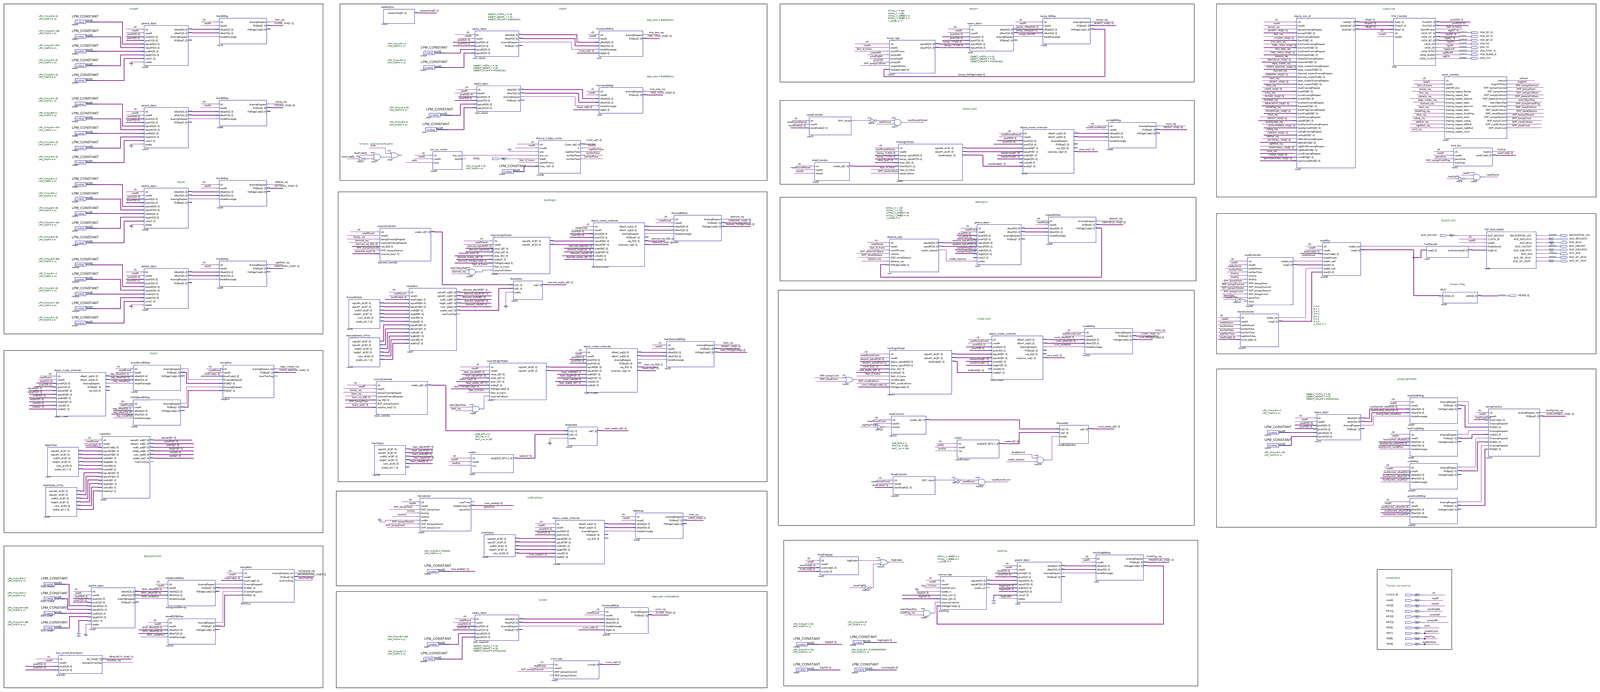
[diagram p0: schematic sheet, whole]
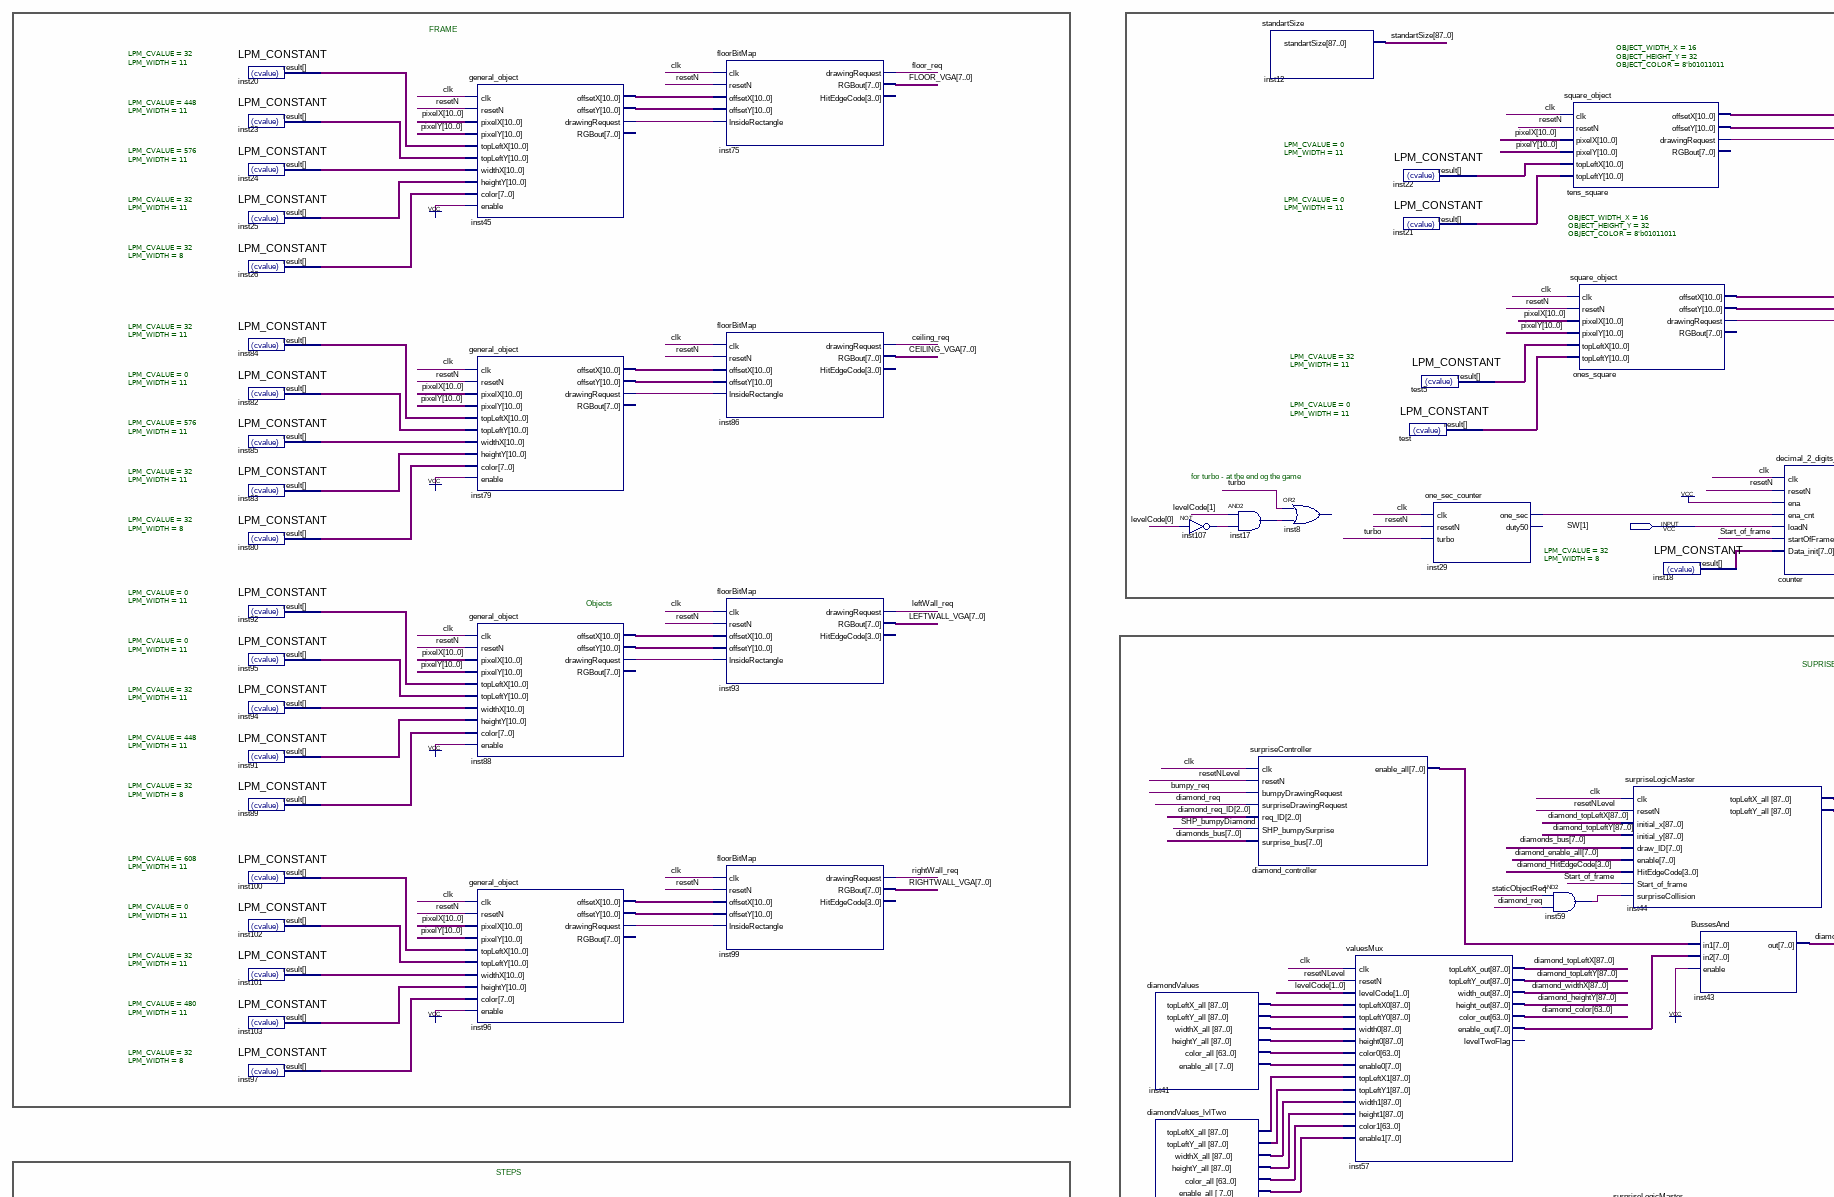
[diagram p1: schematic sheet, upper left part]
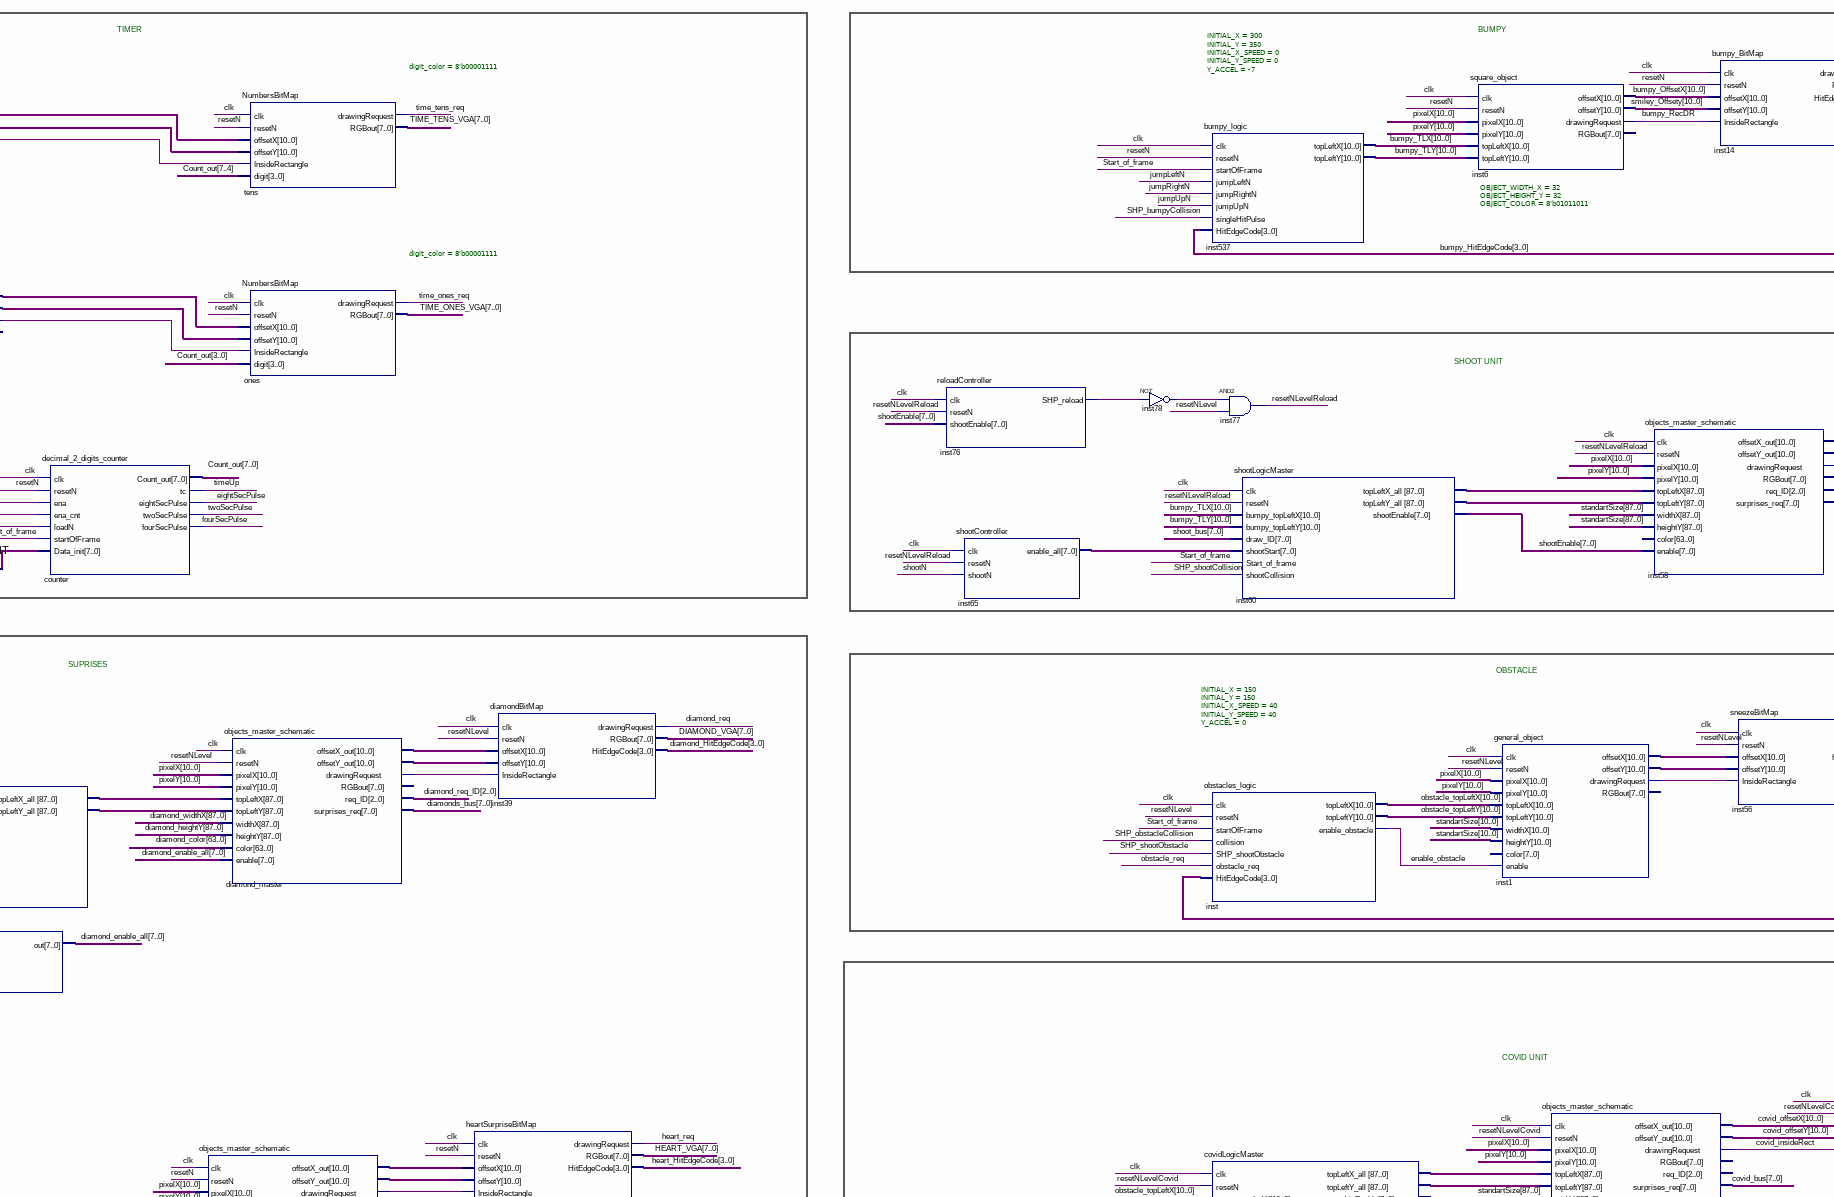
[diagram p2: schematic sheet, upper centre part]
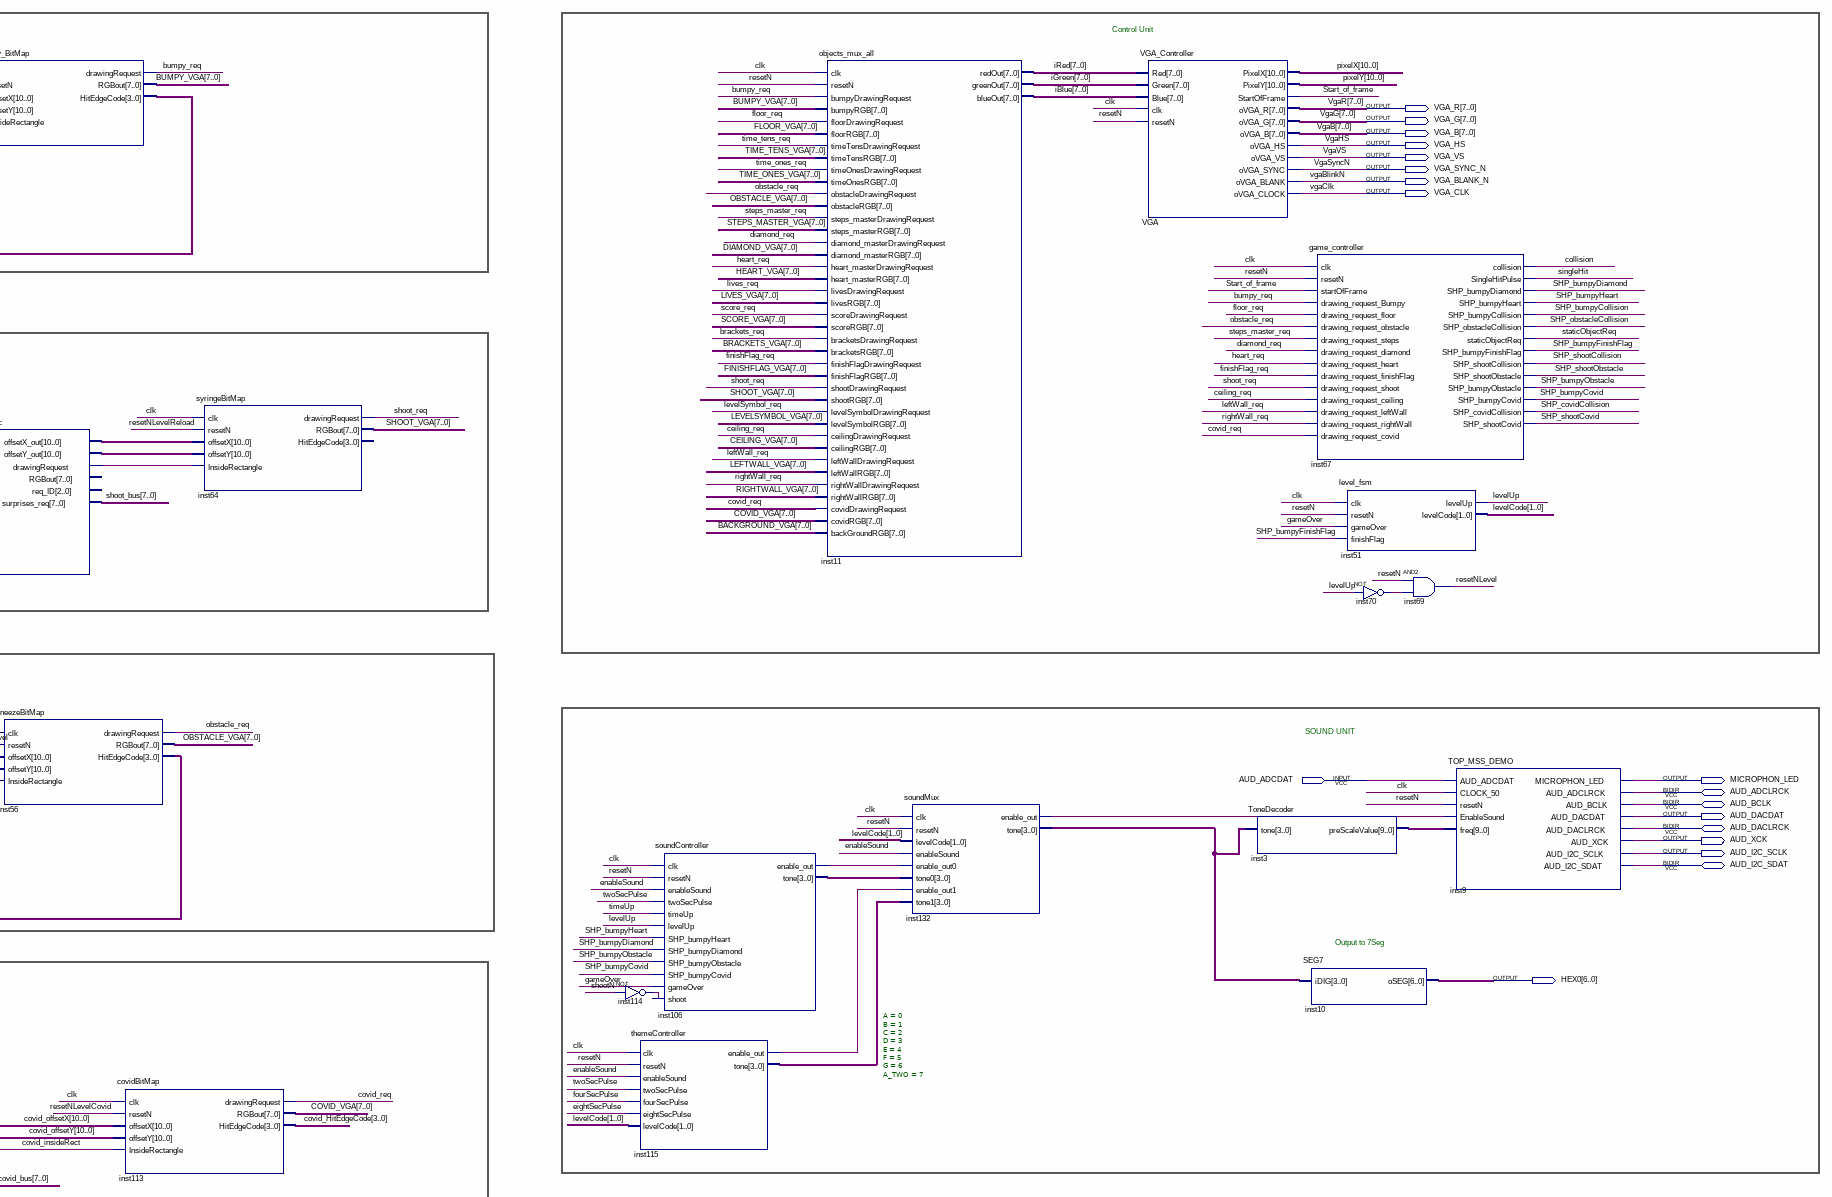
[diagram p3: schematic sheet, upper right part]
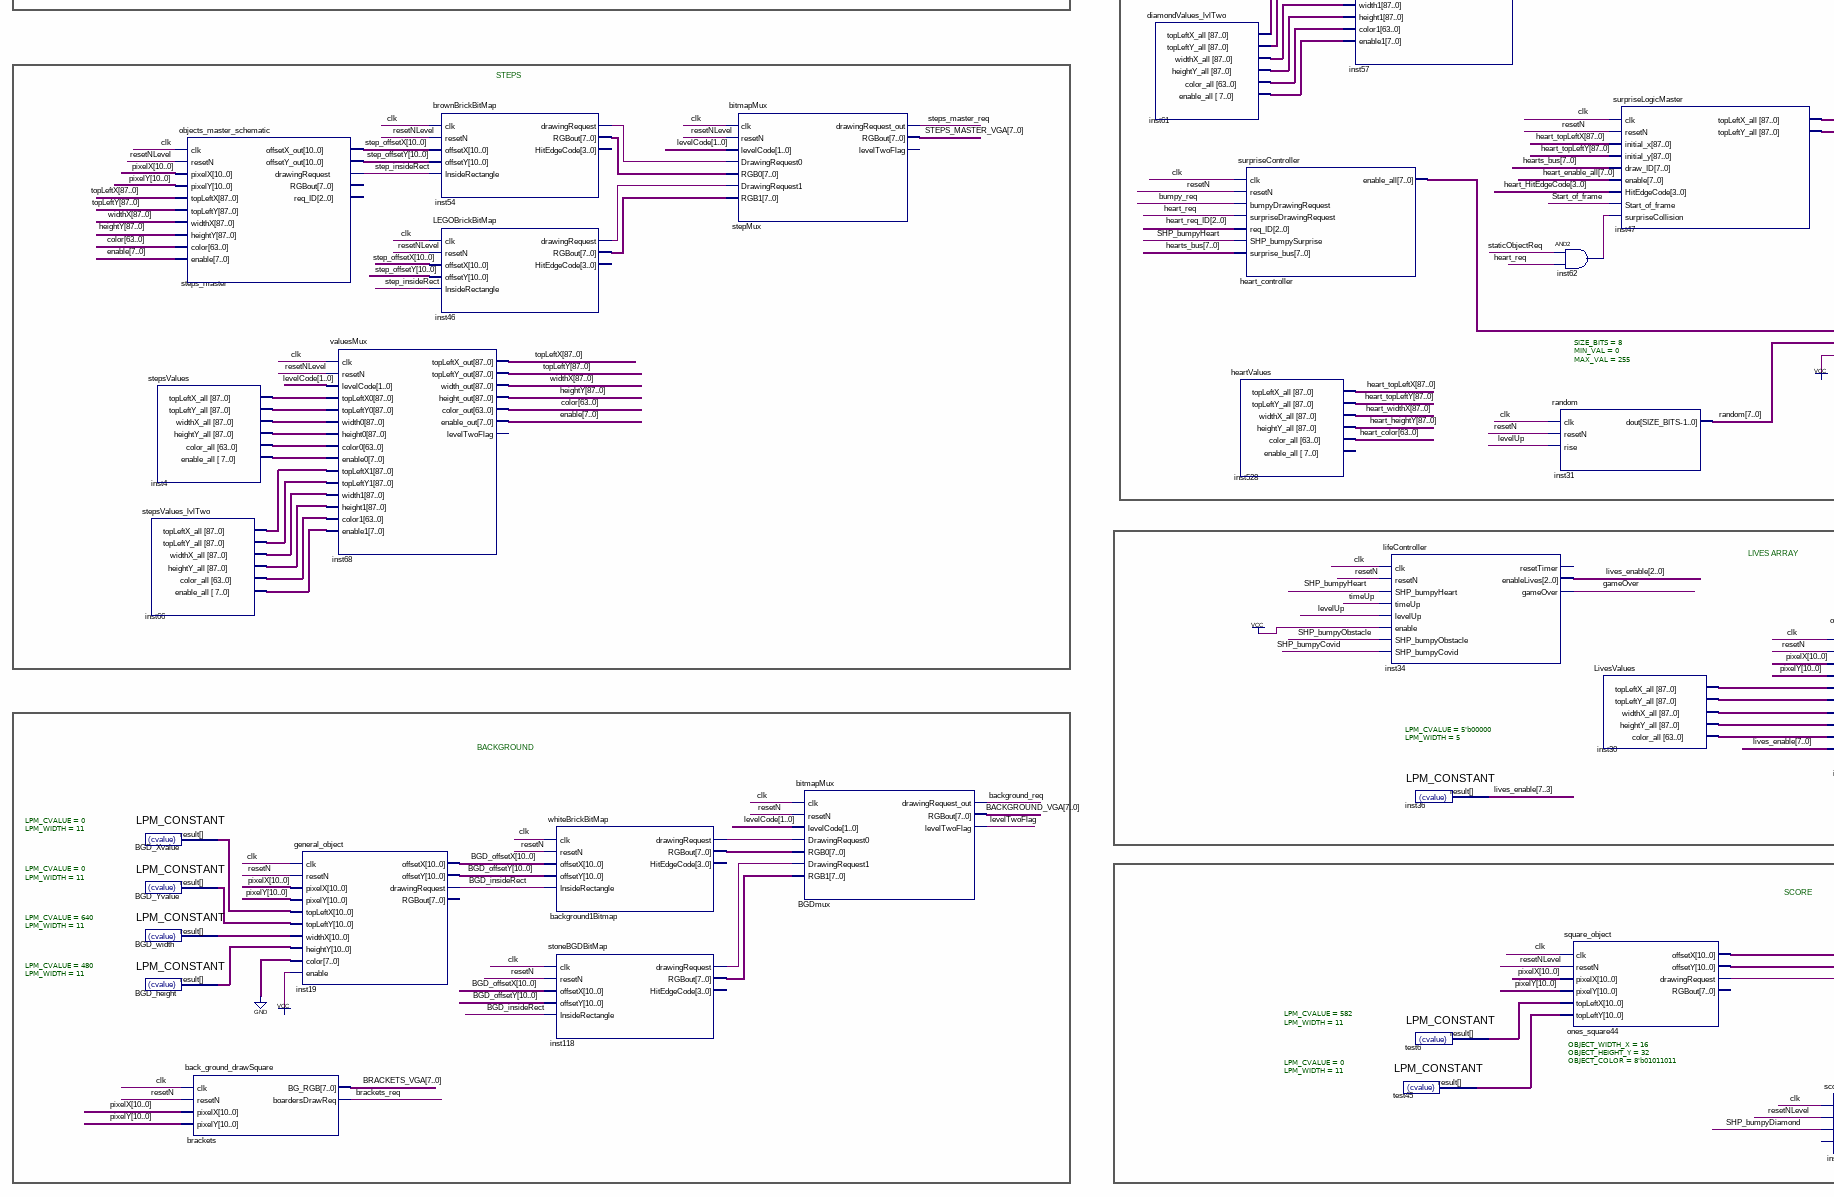
[diagram p4: schematic sheet, lower left part]
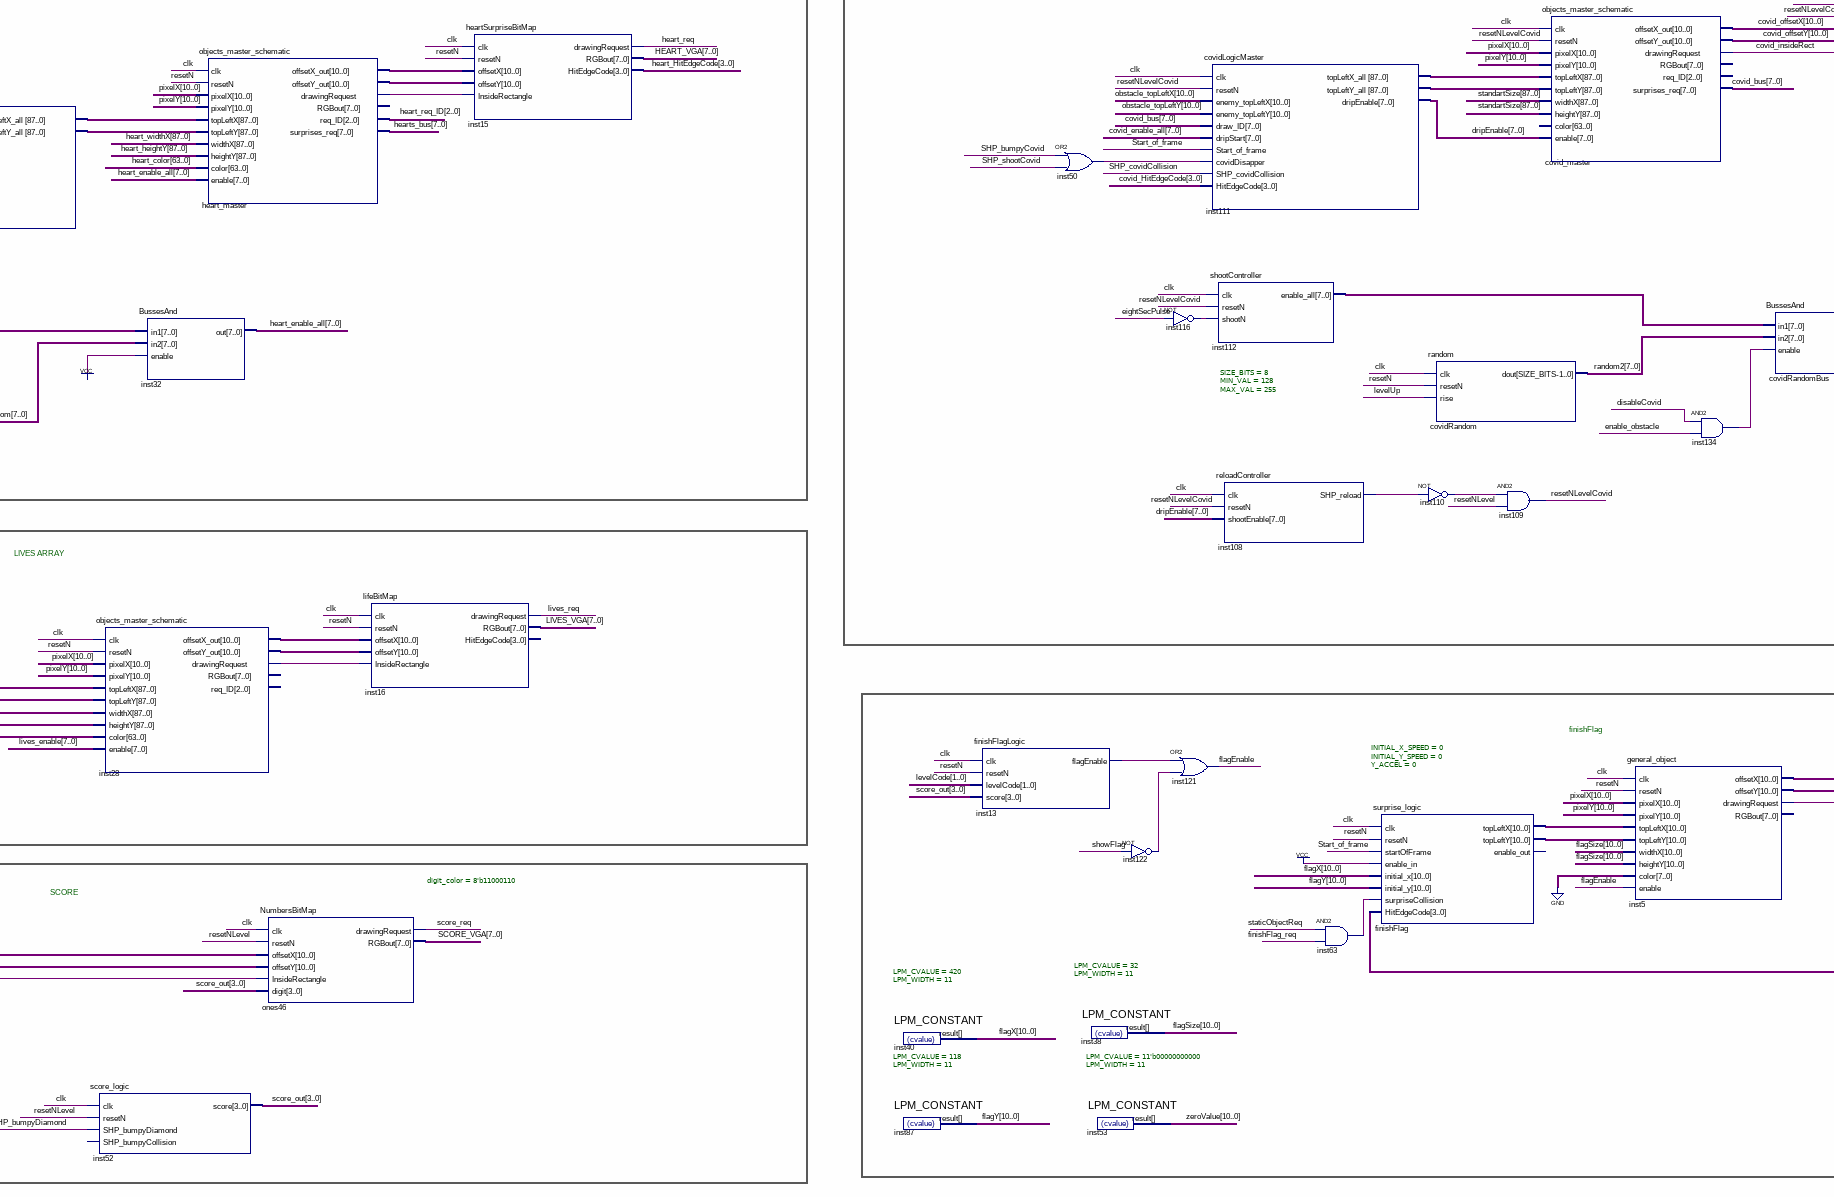
[diagram p5: schematic sheet, lower centre part]
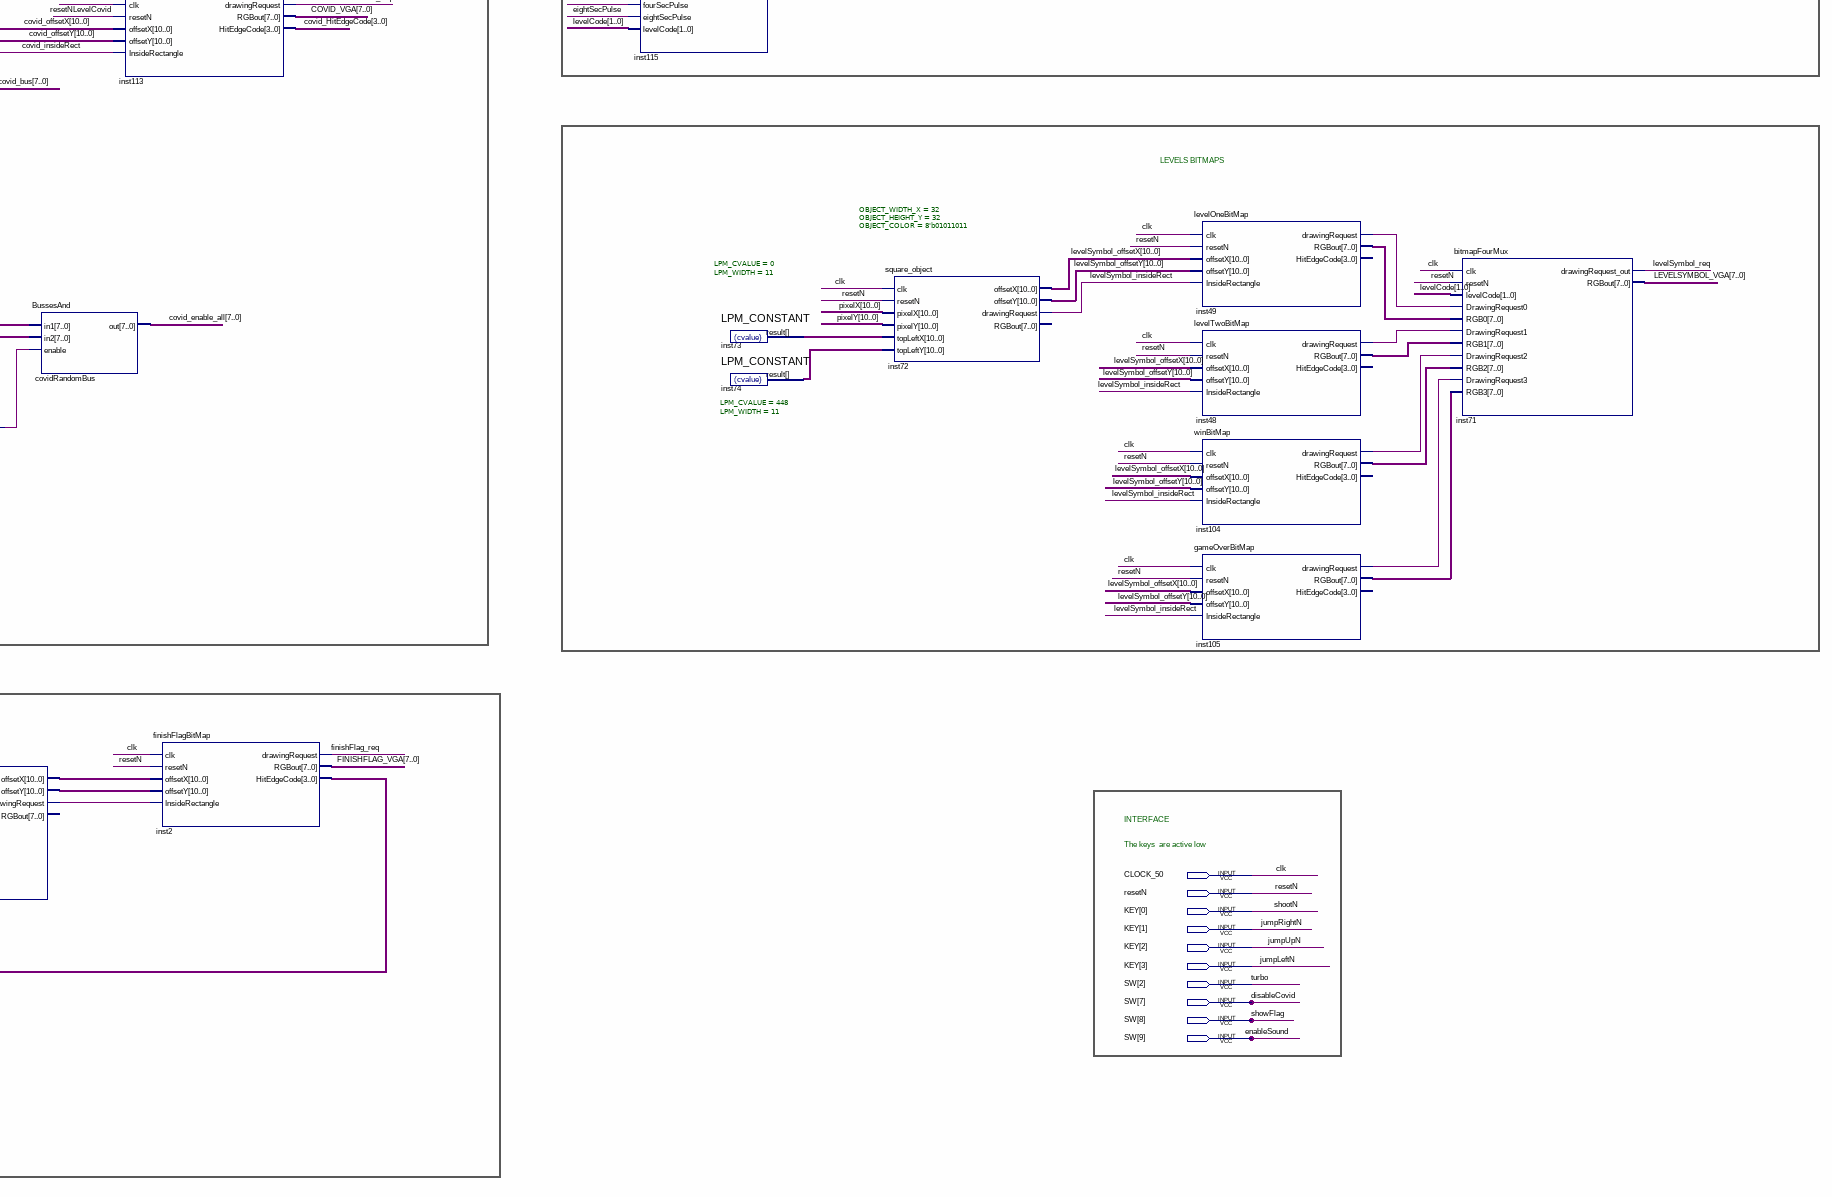
[diagram p6: schematic sheet, lower right part]
// Quartus schematic TOP_VGA_DEMO_WITH_MSS_ALL.bdf as structural Verilog: 143 symbols, 29 pins
module TOP_VGA_DEMO_WITH_MSS_ALL (
  input  [9:1] SW,
  input  AUD_ADCDAT,
  input  CLOCK_50,
  input  resetN,
  input  [3:0] KEY,
  inout  AUD_ADCLRCK,
  inout  AUD_BCLK,
  inout  AUD_DACLRCK,
  inout  AUD_I2C_SDAT,
  output [7:0] VGA_R,
  output [7:0] VGA_G,
  output [7:0] VGA_B,
  output VGA_HS,
  output VGA_VS,
  output VGA_SYNC_N,
  output VGA_BLANK_N,
  output VGA_CLK,
  output MICROPHON_LED,
  output AUD_DACDAT,
  output AUD_XCK,
  output AUD_I2C_SCLK,
  output [6:0] HEX0
);

  wire background1Bitmap_drawingrequest, background_req, BGD_insideRect, brackets_req, bumpy_RecDR,
       bumpy_req, ceiling_req, collision, covid_insideRect, covid_req, diamond_master_drawingrequest,
       diamond_req, eightSecPulse, enable_obstacle, finishFlag_req, flagEnable, floor_req, fourSecPulse,
       gameOver, heart_master_drawingrequest, heart_req, inst1_drawingrequest, inst5_drawingrequest,
       inst13_flagenable, inst17_out, inst28_drawingrequest, inst29_one_sec, inst45_drawingrequest,
       inst46_drawingrequest, inst48_drawingrequest, inst49_drawingrequest, inst50_out,
       inst54_drawingrequest, inst58_drawingrequest, inst59_out, inst62_out, inst63_out, inst70_out,
       inst76_shp_reload, inst78_out, inst79_drawingrequest, inst88_drawingrequest, inst96_drawingrequest,
       inst104_drawingrequest, inst105_drawingrequest, inst106_enable_out, inst107_out, inst108_shp_reload,
       inst110_out, inst114_out, inst115_enable_out, inst116_out, inst118_drawingrequest, inst122_out,
       inst132_enable_out, inst134_out, leftWall_req, levelSymbol_insideRect, levelSymbol_req, levelTwoFlag,
       levelUp, lives_req, obstacle_req, ones_square44_drawingrequest, ones_square_drawingrequest,
       resetNLevel, resetNLevelCovid, resetNLevelReload, rightWall_req, score_req, shoot_req,
       SHP_bumpyCollision, SHP_bumpyCovid, SHP_bumpyDiamond, SHP_bumpyFinishFlag, SHP_bumpyHeart,
       SHP_bumpyObstacle, SHP_covidCollision, SHP_obstacleCollision, SHP_shootCollision, SHP_shootCovid,
       SHP_shootObstacle, singleHit, Start_of_frame, staticObjectReq, step_insideRect, steps_master_req,
       tens_square_drawingrequest, time_ones_req, time_tens_req, timeUp, twoSecPulse;
  wire [1:0] levelCode;
  wire [2:0] diamond_req_ID, heart_req_ID;
  wire [3:0] bumpy_HitEdgeCode, covid_HitEdgeCode, diamond_HitEdgeCode, heart_HitEdgeCode, inst2_hitedgecode,
       inst56_hitedgecode, inst106_tone, inst115_tone, inst132_tone, score_out;
  wire [7:0] background1Bitmap_rgbout, BACKGROUND_VGA, BRACKETS_VGA, BUMPY_VGA, CEILING_VGA, Count_out,
       covid_bus, covid_enable_all, COVID_VGA, diamond_controller_enable_all, diamond_enable_all,
       DIAMOND_VGA, diamonds_bus, dripEnable, enable, FINISHFLAG_VGA, FLOOR_VGA, heart_controller_enable_all,
       heart_enable_all, HEART_VGA, hearts_bus, iBlue, iGreen, inst4_enable_all, inst18_result,
       inst26_result, inst41_enable_all, inst46_rgbout, inst48_rgbout, inst49_rgbout, inst54_rgbout,
       inst57_enable_out, inst61_enable_all, inst65_enable_all, inst66_enable_all, inst80_result,
       inst89_result, inst97_result, inst104_rgbout, inst105_rgbout, inst112_enable_all, inst118_rgbout,
       iRed, LEFTWALL_VGA, LEVELSYMBOL_VGA, lives_enable, LIVES_VGA, OBSTACLE_VGA, random, random2,
       RIGHTWALL_VGA, SCORE_VGA, shoot_bus, SHOOT_VGA, shootEnable, STEPS_MASTER_VGA, TIME_ONES_VGA,
       TIME_TENS_VGA;
  wire [9:0] inst3_prescalevalue;
  wire [10:0] BGD_height_result, BGD_offsetX, BGD_offsetY, BGD_width_result, BGD_Xvalue_result,
       BGD_Yvalue_result, bumpy_OffsetX, bumpy_TLX, bumpy_TLY, covid_offsetX, covid_offsetY,
       diamond_master_offsetx_out, diamond_master_offsety_out, finishFlag_topleftx, finishFlag_toplefty,
       flagSize, flagX, flagY, heart_master_offsetx_out, heart_master_offsety_out, inst1_offsetx,
       inst1_offsety, inst5_offsetx, inst5_offsety, inst20_result, inst21_result, inst22_result,
       inst23_result, inst24_result, inst25_result, inst28_offsetx_out, inst28_offsety_out, inst45_offsetx,
       inst45_offsety, inst58_offsetx_out, inst58_offsety_out, inst73_result, inst74_result, inst79_offsetx,
       inst79_offsety, inst82_result, inst83_result, inst84_result, inst85_result, inst88_offsetx,
       inst88_offsety, inst91_result, inst92_result, inst94_result, inst95_result, inst96_offsetx,
       inst96_offsety, inst100_result, inst101_result, inst102_result, inst103_result, levelSymbol_offsetX,
       levelSymbol_offsetY, obstacle_topLeftX, obstacle_topLeftY, ones_square44_offsetx,
       ones_square44_offsety, ones_square_offsetx, ones_square_offsety, pixelX, pixelY, smiley_Offsety,
       step_offsetX, step_offsetY, tens_square_offsetx, tens_square_offsety, test5_result, test6_result,
       test45_result, test_result, zeroValue;
  wire [63:0] color, diamond_color, heart_color, inst4_color_all, inst30_color_all, inst41_color_all,
       inst61_color_all, inst66_color_all;
  wire [87:0] diamond_heightY, diamond_topLeftX, diamond_topLeftY, diamond_widthX, heart_heightY,
       heart_topLeftX, heart_topLeftY, heart_widthX, heightY, inst4_heighty_all, inst4_topleftx_all,
       inst4_toplefty_all, inst4_widthx_all, inst30_heighty_all, inst30_topleftx_all, inst30_toplefty_all,
       inst30_widthx_all, inst41_heighty_all, inst41_topleftx_all, inst41_toplefty_all, inst41_widthx_all,
       inst44_topleftx_all, inst44_toplefty_all, inst47_topleftx_all, inst47_toplefty_all,
       inst60_topleftx_all, inst60_toplefty_all, inst61_heighty_all, inst61_topleftx_all,
       inst61_toplefty_all, inst61_widthx_all, inst66_heighty_all, inst66_topleftx_all, inst66_toplefty_all,
       inst66_widthx_all, inst111_topleftx_all, inst111_toplefty_all, standartSize, topLeftX, topLeftY,
       widthX;

  stepsValues inst4 (
    .topLeftX_all(inst4_topleftx_all), .topLeftY_all(inst4_toplefty_all), .widthX_all(inst4_widthx_all),
    .heightY_all(inst4_heighty_all), .color_all(inst4_color_all), .enable_all(inst4_enable_all));
  stepsValues_lvlTwo inst66 (
    .topLeftX_all(inst66_topleftx_all), .topLeftY_all(inst66_toplefty_all), .widthX_all(inst66_widthx_all),
    .heightY_all(inst66_heighty_all), .color_all(inst66_color_all), .enable_all(inst66_enable_all));
  LPM_CONSTANT #(.LPM_CVALUE(0), .LPM_WIDTH(11)) BGD_Xvalue (.result(BGD_Xvalue_result));
  LPM_CONSTANT #(.LPM_CVALUE(0), .LPM_WIDTH(11)) BGD_Yvalue (.result(BGD_Yvalue_result));
  LPM_CONSTANT #(.LPM_CVALUE(640), .LPM_WIDTH(11)) BGD_width (.result(BGD_width_result));
  LPM_CONSTANT #(.LPM_CVALUE(480), .LPM_WIDTH(11)) BGD_height (.result(BGD_height_result));
  objects_master_schematic steps_master (
    .clk(CLOCK_50), .resetN(resetNLevel), .pixelX(pixelX), .pixelY(pixelY), .topLeftX(topLeftX),
    .topLeftY(topLeftY), .widthX(widthX), .heightY(heightY), .color(color), .enable(enable),
    .offsetX_out(step_offsetX), .offsetY_out(step_offsetY), .drawingRequest(step_insideRect));  // open: RGBout, req_ID
  back_ground_drawSquare brackets (
    .clk(CLOCK_50), .resetN(resetN), .pixelX(pixelX), .pixelY(pixelY), .BG_RGB(BRACKETS_VGA),
    .boardersDrawReq(brackets_req));
  LPM_CONSTANT #(.LPM_CVALUE(32), .LPM_WIDTH(11)) inst20 (.result(inst20_result));
  LPM_CONSTANT #(.LPM_CVALUE(448), .LPM_WIDTH(11)) inst23 (.result(inst23_result));
  LPM_CONSTANT #(.LPM_CVALUE(576), .LPM_WIDTH(11)) inst24 (.result(inst24_result));
  LPM_CONSTANT #(.LPM_CVALUE(32), .LPM_WIDTH(11)) inst25 (.result(inst25_result));
  LPM_CONSTANT #(.LPM_CVALUE(32), .LPM_WIDTH(8)) inst26 (.result(inst26_result));
  LPM_CONSTANT #(.LPM_CVALUE(32), .LPM_WIDTH(11)) inst84 (.result(inst84_result));
  LPM_CONSTANT #(.LPM_CVALUE(0), .LPM_WIDTH(11)) inst82 (.result(inst82_result));
  LPM_CONSTANT #(.LPM_CVALUE(576), .LPM_WIDTH(11)) inst85 (.result(inst85_result));
  LPM_CONSTANT #(.LPM_CVALUE(32), .LPM_WIDTH(11)) inst83 (.result(inst83_result));
  LPM_CONSTANT #(.LPM_CVALUE(32), .LPM_WIDTH(8)) inst80 (.result(inst80_result));
  LPM_CONSTANT #(.LPM_CVALUE(0), .LPM_WIDTH(11)) inst92 (.result(inst92_result));
  LPM_CONSTANT #(.LPM_CVALUE(0), .LPM_WIDTH(11)) inst95 (.result(inst95_result));
  LPM_CONSTANT #(.LPM_CVALUE(32), .LPM_WIDTH(11)) inst94 (.result(inst94_result));
  LPM_CONSTANT #(.LPM_CVALUE(448), .LPM_WIDTH(11)) inst91 (.result(inst91_result));
  LPM_CONSTANT #(.LPM_CVALUE(32), .LPM_WIDTH(8)) inst89 (.result(inst89_result));
  LPM_CONSTANT #(.LPM_CVALUE(608), .LPM_WIDTH(11)) inst100 (.result(inst100_result));
  LPM_CONSTANT #(.LPM_CVALUE(0), .LPM_WIDTH(11)) inst102 (.result(inst102_result));
  LPM_CONSTANT #(.LPM_CVALUE(32), .LPM_WIDTH(11)) inst101 (.result(inst101_result));
  LPM_CONSTANT #(.LPM_CVALUE(480), .LPM_WIDTH(11)) inst103 (.result(inst103_result));
  LPM_CONSTANT #(.LPM_CVALUE(32), .LPM_WIDTH(8)) inst97 (.result(inst97_result));
  general_object inst19 (
    .clk(CLOCK_50), .resetN(resetN), .pixelX(pixelX), .pixelY(pixelY), .topLeftX(BGD_Xvalue_result),
    .topLeftY(BGD_Yvalue_result), .widthX(BGD_width_result), .heightY(BGD_height_result), .color({8{1'b0}}),
    .enable(1'b1), .offsetX(BGD_offsetX), .offsetY(BGD_offsetY), .drawingRequest(BGD_insideRect));  // open: RGBout
  valuesMux inst68 (
    .clk(CLOCK_50), .resetN(resetNLevel), .levelCode(levelCode), .topLeftX0(inst4_topleftx_all),
    .topLeftY0(inst4_toplefty_all), .width0(inst4_widthx_all), .height0(inst4_heighty_all),
    .color0(inst4_color_all), .enable0(inst4_enable_all), .topLeftX1(inst66_topleftx_all),
    .topLeftY1(inst66_toplefty_all), .width1(inst66_widthx_all), .height1(inst66_heighty_all),
    .color1(inst66_color_all), .enable1(inst66_enable_all), .topLeftX_out(topLeftX), .topLeftY_out(topLeftY),
    .width_out(widthX), .height_out(heightY), .color_out(color), .enable_out(enable));  // open: levelTwoFlag
  brownBrickBitMap inst54 (
    .clk(CLOCK_50), .resetN(resetNLevel), .offsetX(step_offsetX), .offsetY(step_offsetY),
    .InsideRectangle(step_insideRect), .drawingRequest(inst54_drawingrequest), .RGBout(inst54_rgbout));  // open: HitEdgeCode
  LEGOBrickBitMap inst46 (
    .clk(CLOCK_50), .resetN(resetNLevel), .offsetX(step_offsetX), .offsetY(step_offsetY),
    .InsideRectangle(step_insideRect), .drawingRequest(inst46_drawingrequest), .RGBout(inst46_rgbout));  // open: HitEdgeCode
  general_object inst45 (
    .clk(CLOCK_50), .resetN(resetN), .pixelX(pixelX), .pixelY(pixelY), .topLeftX(inst20_result),
    .topLeftY(inst23_result), .widthX(inst24_result), .heightY(inst25_result), .color(inst26_result),
    .enable(1'b1), .offsetX(inst45_offsetx), .offsetY(inst45_offsety), .drawingRequest(inst45_drawingrequest));  // open: RGBout
  general_object inst79 (
    .clk(CLOCK_50), .resetN(resetN), .pixelX(pixelX), .pixelY(pixelY), .topLeftX(inst84_result),
    .topLeftY(inst82_result), .widthX(inst85_result), .heightY(inst83_result), .color(inst80_result),
    .enable(1'b1), .offsetX(inst79_offsetx), .offsetY(inst79_offsety), .drawingRequest(inst79_drawingrequest));  // open: RGBout
  general_object inst88 (
    .clk(CLOCK_50), .resetN(resetN), .pixelX(pixelX), .pixelY(pixelY), .topLeftX(inst92_result),
    .topLeftY(inst95_result), .widthX(inst94_result), .heightY(inst91_result), .color(inst89_result),
    .enable(1'b1), .offsetX(inst88_offsetx), .offsetY(inst88_offsety), .drawingRequest(inst88_drawingrequest));  // open: RGBout
  general_object inst96 (
    .clk(CLOCK_50), .resetN(resetN), .pixelX(pixelX), .pixelY(pixelY), .topLeftX(inst100_result),
    .topLeftY(inst102_result), .widthX(inst101_result), .heightY(inst103_result), .color(inst97_result),
    .enable(1'b1), .offsetX(inst96_offsetx), .offsetY(inst96_offsety), .drawingRequest(inst96_drawingrequest));  // open: RGBout
  whiteBrickBitMap background1Bitmap (
    .clk(CLOCK_50), .resetN(resetN), .offsetX(BGD_offsetX), .offsetY(BGD_offsetY),
    .InsideRectangle(BGD_insideRect), .drawingRequest(background1Bitmap_drawingrequest),
    .RGBout(background1Bitmap_rgbout));  // open: HitEdgeCode
  stoneBGDBitMap inst118 (
    .clk(CLOCK_50), .resetN(resetN), .offsetX(BGD_offsetX), .offsetY(BGD_offsetY),
    .InsideRectangle(BGD_insideRect), .drawingRequest(inst118_drawingrequest), .RGBout(inst118_rgbout));  // open: HitEdgeCode
  floorBitMap inst75 (
    .clk(CLOCK_50), .resetN(resetN), .offsetX(inst45_offsetx), .offsetY(inst45_offsety),
    .InsideRectangle(inst45_drawingrequest), .drawingRequest(floor_req), .RGBout(FLOOR_VGA));  // open: HitEdgeCode
  floorBitMap inst86 (
    .clk(CLOCK_50), .resetN(resetN), .offsetX(inst79_offsetx), .offsetY(inst79_offsety),
    .InsideRectangle(inst79_drawingrequest), .drawingRequest(ceiling_req), .RGBout(CEILING_VGA));  // open: HitEdgeCode
  floorBitMap inst93 (
    .clk(CLOCK_50), .resetN(resetN), .offsetX(inst88_offsetx), .offsetY(inst88_offsety),
    .InsideRectangle(inst88_drawingrequest), .drawingRequest(leftWall_req), .RGBout(LEFTWALL_VGA));  // open: HitEdgeCode
  floorBitMap inst99 (
    .clk(CLOCK_50), .resetN(resetN), .offsetX(inst96_offsetx), .offsetY(inst96_offsety),
    .InsideRectangle(inst96_drawingrequest), .drawingRequest(rightWall_req), .RGBout(RIGHTWALL_VGA));  // open: HitEdgeCode
  bitmapMux stepMux (
    .clk(CLOCK_50), .resetN(resetNLevel), .levelCode(levelCode), .DrawingRequest0(inst54_drawingrequest),
    .RGB0(inst54_rgbout), .DrawingRequest1(inst46_drawingrequest), .RGB1(inst46_rgbout),
    .drawingRequest_out(steps_master_req), .RGBout(STEPS_MASTER_VGA));  // open: levelTwoFlag
  bitmapMux BGDmux (
    .clk(CLOCK_50), .resetN(resetN), .levelCode(levelCode),
    .DrawingRequest0(background1Bitmap_drawingrequest), .RGB0(background1Bitmap_rgbout),
    .DrawingRequest1(inst118_drawingrequest), .RGB1(inst118_rgbout), .drawingRequest_out(background_req),
    .RGBout(BACKGROUND_VGA), .levelTwoFlag(levelTwoFlag));
  diamondValues inst41 (
    .topLeftX_all(inst41_topleftx_all), .topLeftY_all(inst41_toplefty_all), .widthX_all(inst41_widthx_all),
    .heightY_all(inst41_heighty_all), .color_all(inst41_color_all), .enable_all(inst41_enable_all));
  diamondValues_lvlTwo inst61 (
    .topLeftX_all(inst61_topleftx_all), .topLeftY_all(inst61_toplefty_all), .widthX_all(inst61_widthx_all),
    .heightY_all(inst61_heighty_all), .color_all(inst61_color_all), .enable_all(inst61_enable_all));
  not inst107 (inst107_out, levelCode[0]);
  standartSize inst12 (.standartSize(standartSize));
  and inst17 (inst17_out, levelCode[1], inst107_out);
  surpriseController diamond_controller (
    .clk(CLOCK_50), .resetN(resetNLevel), .bumpyDrawingRequest(bumpy_req),
    .surpriseDrawingRequest(diamond_req), .req_ID(diamond_req_ID), .SHP_bumpySurprise(SHP_bumpyDiamond),
    .surprise_bus(diamonds_bus), .enable_all(diamond_controller_enable_all));
  surpriseController heart_controller (
    .clk(CLOCK_50), .resetN(resetN), .bumpyDrawingRequest(bumpy_req), .surpriseDrawingRequest(heart_req),
    .req_ID(heart_req_ID), .SHP_bumpySurprise(SHP_bumpyHeart), .surprise_bus(hearts_bus),
    .enable_all(heart_controller_enable_all));
  heartValues inst528 (
    .topLeftX_all(heart_topLeftX), .topLeftY_all(heart_topLeftY), .widthX_all(heart_widthX),
    .heightY_all(heart_heightY), .color_all(heart_color));  // open: enable_all
  // OR2 inst8 has open pins: IN1=SW[2], IN2=inst17_out, OUT=open
  valuesMux inst57 (
    .clk(CLOCK_50), .resetN(resetNLevel), .levelCode(levelCode), .topLeftX0(inst41_topleftx_all),
    .topLeftY0(inst41_toplefty_all), .width0(inst41_widthx_all), .height0(inst41_heighty_all),
    .color0(inst41_color_all), .enable0(inst41_enable_all), .topLeftX1(inst61_topleftx_all),
    .topLeftY1(inst61_toplefty_all), .width1(inst61_widthx_all), .height1(inst61_heighty_all),
    .color1(inst61_color_all), .enable1(inst61_enable_all), .topLeftX_out(diamond_topLeftX),
    .topLeftY_out(diamond_topLeftY), .width_out(diamond_widthX), .height_out(diamond_heightY),
    .color_out(diamond_color), .enable_out(inst57_enable_out));  // open: levelTwoFlag
  LPM_CONSTANT #(.LPM_CVALUE(0), .LPM_WIDTH(11)) inst22 (.result(inst22_result));
  LPM_CONSTANT #(.LPM_CVALUE(0), .LPM_WIDTH(11)) inst21 (.result(inst21_result));
  LPM_CONSTANT #(.LPM_CVALUE(32), .LPM_WIDTH(11)) test5 (.result(test5_result));
  LPM_CONSTANT #(.LPM_CVALUE(0), .LPM_WIDTH(11)) test (.result(test_result));
  lifeController inst34 (
    .clk(CLOCK_50), .resetN(resetN), .SHP_bumpyHeart(SHP_bumpyHeart), .timeUp(timeUp), .levelUp(levelUp),
    .enable(1'b1), .SHP_bumpyObstacle(SHP_bumpyObstacle), .SHP_bumpyCovid(SHP_bumpyCovid),
    .enableLives(lives_enable[2:0]), .gameOver(gameOver));  // open: resetTimer
  LPM_CONSTANT #(.LPM_CVALUE(5'b00000), .LPM_WIDTH(5)) inst36 (.result(lives_enable[7:3]));
  LPM_CONSTANT #(.LPM_CVALUE(582), .LPM_WIDTH(11)) test6 (.result(test6_result));
  LPM_CONSTANT #(.LPM_CVALUE(0), .LPM_WIDTH(11)) test45 (.result(test45_result));
  one_sec_counter inst29 (.clk(CLOCK_50), .resetN(resetN), .turbo(SW[2]), .one_sec(inst29_one_sec));  // open: duty50
  square_object #(.OBJECT_WIDTH_X(16), .OBJECT_HEIGHT_Y(32), .OBJECT_COLOR(8'b01011011)) tens_square (
    .clk(CLOCK_50), .resetN(resetN), .pixelX(pixelX), .pixelY(pixelY), .topLeftX(inst22_result),
    .topLeftY(inst21_result), .offsetX(tens_square_offsetx), .offsetY(tens_square_offsety),
    .drawingRequest(tens_square_drawingrequest));  // open: RGBout
  and inst59 (inst59_out, staticObjectReq, diamond_req);
  and inst62 (inst62_out, staticObjectReq, heart_req);
  random #(.SIZE_BITS(8), .MIN_VAL(0), .MAX_VAL(255)) inst31 (
    .clk(CLOCK_50), .resetN(resetN), .rise(levelUp), .dout(random));
  square_object #(.OBJECT_WIDTH_X(16), .OBJECT_HEIGHT_Y(32), .OBJECT_COLOR(8'b01011011)) ones_square44 (
    .clk(CLOCK_50), .resetN(resetNLevel), .pixelX(pixelX), .pixelY(pixelY), .topLeftX(test6_result),
    .topLeftY(test45_result), .offsetX(ones_square44_offsetx), .offsetY(ones_square44_offsety),
    .drawingRequest(ones_square44_drawingrequest));  // open: RGBout
  square_object #(.OBJECT_WIDTH_X(16), .OBJECT_HEIGHT_Y(32), .OBJECT_COLOR(8'b01011011)) ones_square (
    .clk(CLOCK_50), .resetN(resetN), .pixelX(pixelX), .pixelY(pixelY), .topLeftX(test5_result),
    .topLeftY(test_result), .offsetX(ones_square_offsetx), .offsetY(ones_square_offsety),
    .drawingRequest(ones_square_drawingrequest));  // open: RGBout
  surpriseLogicMaster inst47 (
    .clk(CLOCK_50), .resetN(resetN), .initial_x(heart_topLeftX), .initial_y(heart_topLeftY),
    .draw_ID(hearts_bus), .enable(heart_enable_all), .HitEdgeCode(heart_HitEdgeCode),
    .Start_of_frame(Start_of_frame), .surpriseCollision(inst62_out), .topLeftX_all(inst47_topleftx_all),
    .topLeftY_all(inst47_toplefty_all));
  LivesValues inst30 (
    .topLeftX_all(inst30_topleftx_all), .topLeftY_all(inst30_toplefty_all), .widthX_all(inst30_widthx_all),
    .heightY_all(inst30_heighty_all), .color_all(inst30_color_all));
  LPM_CONSTANT #(.LPM_CVALUE(32), .LPM_WIDTH(8)) inst18 (.result(inst18_result));
  surpriseLogicMaster inst44 (
    .clk(CLOCK_50), .resetN(resetNLevel), .initial_x(diamond_topLeftX), .initial_y(diamond_topLeftY),
    .draw_ID(diamonds_bus), .enable(diamond_enable_all), .HitEdgeCode(diamond_HitEdgeCode),
    .Start_of_frame(Start_of_frame), .surpriseCollision(inst59_out), .topLeftX_all(inst44_topleftx_all),
    .topLeftY_all(inst44_toplefty_all));
  BussesAnd inst43 (
    .in1(diamond_controller_enable_all), .in2(inst57_enable_out), .enable(1'b1), .out(diamond_enable_all));
  decimal_2_digits_counter counter (
    .clk(CLOCK_50), .resetN(resetN), .ena(1'b1), .ena_cnt(inst29_one_sec), .loadN(SW[1]),
    .startOfFrame(Start_of_frame), .Data_init(inst18_result), .Count_out(Count_out), .tc(timeUp),
    .eightSecPulse(eightSecPulse), .twoSecPulse(twoSecPulse), .fourSecPulse(fourSecPulse));
  objects_master_schematic inst28 (
    .clk(CLOCK_50), .resetN(resetN), .pixelX(pixelX), .pixelY(pixelY), .topLeftX(inst30_topleftx_all),
    .topLeftY(inst30_toplefty_all), .widthX(inst30_widthx_all), .heightY(inst30_heighty_all),
    .color(inst30_color_all), .enable(lives_enable), .offsetX_out(inst28_offsetx_out),
    .offsetY_out(inst28_offsety_out), .drawingRequest(inst28_drawingrequest));  // open: RGBout, req_ID
  score_logic inst52 (
    .clk(CLOCK_50), .resetN(resetNLevel), .SHP_bumpyDiamond(SHP_bumpyDiamond), .score(score_out));  // open: SHP_bumpyCollision
  BussesAnd inst32 (.in1(heart_controller_enable_all), .in2(random), .enable(1'b1), .out(heart_enable_all));
  objects_master_schematic heart_master (
    .clk(CLOCK_50), .resetN(resetN), .pixelX(pixelX), .pixelY(pixelY), .topLeftX(inst47_topleftx_all),
    .topLeftY(inst47_toplefty_all), .widthX(heart_widthX), .heightY(heart_heightY), .color(heart_color),
    .enable(heart_enable_all), .offsetX_out(heart_master_offsetx_out),
    .offsetY_out(heart_master_offsety_out), .drawingRequest(heart_master_drawingrequest),
    .req_ID(heart_req_ID), .surprises_req(hearts_bus));  // open: RGBout
  NumbersBitMap #(.digit_color(8'b00001111)) tens (
    .clk(CLOCK_50), .resetN(resetN), .offsetX(tens_square_offsetx), .offsetY(tens_square_offsety),
    .InsideRectangle(tens_square_drawingrequest), .digit(Count_out[7:4]), .drawingRequest(time_tens_req),
    .RGBout(TIME_TENS_VGA));
  NumbersBitMap #(.digit_color(8'b00001111)) ones (
    .clk(CLOCK_50), .resetN(resetN), .offsetX(ones_square_offsetx), .offsetY(ones_square_offsety),
    .InsideRectangle(ones_square_drawingrequest), .digit(Count_out[3:0]), .drawingRequest(time_ones_req),
    .RGBout(TIME_ONES_VGA));
  objects_master_schematic diamond_master (
    .clk(CLOCK_50), .resetN(resetNLevel), .pixelX(pixelX), .pixelY(pixelY), .topLeftX(inst44_topleftx_all),
    .topLeftY(inst44_toplefty_all), .widthX(diamond_widthX), .heightY(diamond_heightY),
    .color(diamond_color), .enable(diamond_enable_all), .offsetX_out(diamond_master_offsetx_out),
    .offsetY_out(diamond_master_offsety_out), .drawingRequest(diamond_master_drawingrequest),
    .req_ID(diamond_req_ID), .surprises_req(diamonds_bus));  // open: RGBout
  NumbersBitMap #(.digit_color(8'b11000110)) ones46 (
    .clk(CLOCK_50), .resetN(resetNLevel), .offsetX(ones_square44_offsetx), .offsetY(ones_square44_offsety),
    .InsideRectangle(ones_square44_drawingrequest), .digit(score_out), .drawingRequest(score_req),
    .RGBout(SCORE_VGA));
  lifeBitMap inst16 (
    .clk(CLOCK_50), .resetN(resetN), .offsetX(inst28_offsetx_out), .offsetY(inst28_offsety_out),
    .InsideRectangle(inst28_drawingrequest), .drawingRequest(lives_req), .RGBout(LIVES_VGA));  // open: HitEdgeCode
  diamondBitMap inst39 (
    .clk(CLOCK_50), .resetN(resetNLevel), .offsetX(diamond_master_offsetx_out),
    .offsetY(diamond_master_offsety_out), .InsideRectangle(diamond_master_drawingrequest),
    .drawingRequest(diamond_req), .RGBout(DIAMOND_VGA), .HitEdgeCode(diamond_HitEdgeCode));
  heartSurpriseBitMap inst15 (
    .clk(CLOCK_50), .resetN(resetN), .offsetX(heart_master_offsetx_out), .offsetY(heart_master_offsety_out),
    .InsideRectangle(heart_master_drawingrequest), .drawingRequest(heart_req), .RGBout(HEART_VGA),
    .HitEdgeCode(heart_HitEdgeCode));
  LPM_CONSTANT #(.LPM_CVALUE(420), .LPM_WIDTH(11)) inst40 (.result(flagX));
  LPM_CONSTANT #(.LPM_CVALUE(118), .LPM_WIDTH(11)) inst87 (.result(flagY));
  reloadController inst76 (
    .clk(CLOCK_50), .resetN(resetNLevelReload), .shootEnable(shootEnable), .SHP_reload(inst76_shp_reload));
  shootController inst65 (.clk(CLOCK_50), .resetN(resetNLevelReload), .shootN(KEY[0]), .enable_all(inst65_enable_all));
  finishFlagLogic inst13 (
    .clk(CLOCK_50), .resetN(resetN), .levelCode(levelCode), .score(score_out), .flagEnable(inst13_flagenable));
  or inst50 (inst50_out, SHP_bumpyCovid, SHP_shootCovid);
  LPM_CONSTANT #(.LPM_CVALUE(32), .LPM_WIDTH(11)) inst38 (.result(flagSize));
  LPM_CONSTANT #(.LPM_CVALUE(11'b00000000000), .LPM_WIDTH(11)) inst53 (.result(zeroValue));
  not inst122 (inst122_out, SW[8]);
  not inst78 (inst78_out, inst76_shp_reload);
  not inst116 (inst116_out, eightSecPulse);
  or inst121 (flagEnable, inst13_flagenable, inst122_out);
  bumpy_logic #(.INITIAL_X(300), .INITIAL_Y(350), .INITIAL_X_SPEED(0), .INITIAL_Y_SPEED(0), .Y_ACCEL(-7)) inst537 (
    .clk(CLOCK_50), .resetN(resetN), .startOfFrame(Start_of_frame), .jumpLeftN(KEY[3]), .jumpRightN(KEY[1]),
    .jumpUpN(KEY[2]), .singleHitPulse(SHP_bumpyCollision), .HitEdgeCode(bumpy_HitEdgeCode),
    .topLeftX(bumpy_TLX), .topLeftY(bumpy_TLY));
  and inst77 (resetNLevelReload, inst78_out, resetNLevel);
  shootLogicMaster inst60 (
    .clk(CLOCK_50), .resetN(resetNLevelReload), .bumpy_topLeftX(bumpy_TLX), .bumpy_topLeftY(bumpy_TLY),
    .draw_ID(shoot_bus), .shootStart(inst65_enable_all), .Start_of_frame(Start_of_frame),
    .shootCollision(SHP_shootCollision), .topLeftX_all(inst60_topleftx_all),
    .topLeftY_all(inst60_toplefty_all), .shootEnable(shootEnable));
  obstacles_logic #(.INITIAL_X(150), .INITIAL_Y(150), .INITIAL_X_SPEED(40), .INITIAL_Y_SPEED(40), .Y_ACCEL(0)) inst (
    .clk(CLOCK_50), .resetN(resetNLevel), .startOfFrame(Start_of_frame), .collision(SHP_obstacleCollision),
    .SHP_shootObstacle(SHP_shootObstacle), .obstacle_req(obstacle_req), .HitEdgeCode(inst56_hitedgecode),
    .topLeftX(obstacle_topLeftX), .topLeftY(obstacle_topLeftY), .enable_obstacle(enable_obstacle));
  covidLogicMaster inst111 (
    .clk(CLOCK_50), .resetN(resetNLevelCovid), .enemy_topLeftX(obstacle_topLeftX),
    .enemy_topLeftY(obstacle_topLeftY), .draw_ID(covid_bus), .dripStart(covid_enable_all),
    .Start_of_frame(Start_of_frame), .covidDisapper(inst50_out), .SHP_covidCollision(SHP_covidCollision),
    .HitEdgeCode(covid_HitEdgeCode), .topLeftX_all(inst111_topleftx_all),
    .topLeftY_all(inst111_toplefty_all), .dripEnable(dripEnable));
  shootController inst112 (
    .clk(CLOCK_50), .resetN(resetNLevelCovid), .shootN(inst116_out), .enable_all(inst112_enable_all));
  reloadController inst108 (
    .clk(CLOCK_50), .resetN(resetNLevelCovid), .shootEnable(dripEnable), .SHP_reload(inst108_shp_reload));
  and inst63 (inst63_out, staticObjectReq, finishFlag_req);
  surprise_logic #(.INITIAL_X_SPEED(0), .INITIAL_Y_SPEED(0), .Y_ACCEL(0)) finishFlag (
    .clk(CLOCK_50), .resetN(resetN), .startOfFrame(Start_of_frame), .enable_in(1'b1), .initial_x(flagX),
    .initial_y(flagY), .surpriseCollision(inst63_out), .HitEdgeCode(inst2_hitedgecode),
    .topLeftX(finishFlag_topleftx), .topLeftY(finishFlag_toplefty));  // open: enable_out
  random #(.SIZE_BITS(8), .MIN_VAL(128), .MAX_VAL(255)) covidRandom (
    .clk(CLOCK_50), .resetN(resetN), .rise(levelUp), .dout(random2));
  not inst110 (inst110_out, inst108_shp_reload);
  square_object #(.OBJECT_WIDTH_X(32), .OBJECT_HEIGHT_Y(32), .OBJECT_COLOR(8'b01011011)) inst6 (
    .clk(CLOCK_50), .resetN(resetN), .pixelX(pixelX), .pixelY(pixelY), .topLeftX(bumpy_TLX),
    .topLeftY(bumpy_TLY), .offsetX(bumpy_OffsetX), .offsetY(smiley_Offsety), .drawingRequest(bumpy_RecDR));  // open: RGBout
  general_object inst1 (
    .clk(CLOCK_50), .resetN(resetNLevel), .pixelX(pixelX), .pixelY(pixelY), .topLeftX(obstacle_topLeftX),
    .topLeftY(obstacle_topLeftY), .widthX(standartSize[10:0]), .heightY(standartSize[10:0]),
    .enable(enable_obstacle), .offsetX(inst1_offsetx), .offsetY(inst1_offsety),
    .drawingRequest(inst1_drawingrequest));  // open: color, RGBout
  and inst109 (resetNLevelCovid, inst110_out, resetNLevel);
  objects_master_schematic covid_master (
    .clk(CLOCK_50), .resetN(resetNLevelCovid), .pixelX(pixelX), .pixelY(pixelY),
    .topLeftX(inst111_topleftx_all), .topLeftY(inst111_toplefty_all), .widthX(standartSize),
    .heightY(standartSize), .enable(dripEnable), .offsetX_out(covid_offsetX), .offsetY_out(covid_offsetY),
    .drawingRequest(covid_insideRect), .surprises_req(covid_bus));  // open: color, RGBout, req_ID
  objects_master_schematic inst58 (
    .clk(CLOCK_50), .resetN(resetNLevelReload), .pixelX(pixelX), .pixelY(pixelY),
    .topLeftX(inst60_topleftx_all), .topLeftY(inst60_toplefty_all), .widthX(standartSize),
    .heightY(standartSize), .enable(shootEnable), .offsetX_out(inst58_offsetx_out),
    .offsetY_out(inst58_offsety_out), .drawingRequest(inst58_drawingrequest), .surprises_req(shoot_bus));  // open: color, RGBout, req_ID
  general_object inst5 (
    .clk(CLOCK_50), .resetN(resetN), .pixelX(pixelX), .pixelY(pixelY), .topLeftX(finishFlag_topleftx),
    .topLeftY(finishFlag_toplefty), .widthX(flagSize), .heightY(flagSize), .color({8{1'b0}}),
    .enable(flagEnable), .offsetX(inst5_offsetx), .offsetY(inst5_offsety),
    .drawingRequest(inst5_drawingrequest));  // open: RGBout
  bumpy_BitMap inst14 (
    .clk(CLOCK_50), .resetN(resetN), .offsetX(bumpy_OffsetX), .offsetY(smiley_Offsety),
    .InsideRectangle(bumpy_RecDR), .drawingRequest(bumpy_req), .RGBout(BUMPY_VGA),
    .HitEdgeCode(bumpy_HitEdgeCode));
  and inst134 (inst134_out, SW[7], enable_obstacle);
  sneezeBitMap inst56 (
    .clk(CLOCK_50), .resetN(resetNLevel), .offsetX(inst1_offsetx), .offsetY(inst1_offsety),
    .InsideRectangle(inst1_drawingrequest), .drawingRequest(obstacle_req), .RGBout(OBSTACLE_VGA),
    .HitEdgeCode(inst56_hitedgecode));
  BussesAnd covidRandomBus (.in1(inst112_enable_all), .in2(random2), .enable(inst134_out), .out(covid_enable_all));
  covidBitMap inst113 (
    .clk(CLOCK_50), .resetN(resetNLevelCovid), .offsetX(covid_offsetX), .offsetY(covid_offsetY),
    .InsideRectangle(covid_insideRect), .drawingRequest(covid_req), .RGBout(COVID_VGA),
    .HitEdgeCode(covid_HitEdgeCode));
  finishFlagBitMap inst2 (
    .clk(CLOCK_50), .resetN(resetN), .offsetX(inst5_offsetx), .offsetY(inst5_offsety),
    .InsideRectangle(inst5_drawingrequest), .drawingRequest(finishFlag_req), .RGBout(FINISHFLAG_VGA),
    .HitEdgeCode(inst2_hitedgecode));
  syringeBitMap inst64 (
    .clk(CLOCK_50), .resetN(resetNLevelReload), .offsetX(inst58_offsetx_out), .offsetY(inst58_offsety_out),
    .InsideRectangle(inst58_drawingrequest), .drawingRequest(shoot_req), .RGBout(SHOOT_VGA));  // open: HitEdgeCode
  soundController inst106 (
    .clk(CLOCK_50), .resetN(resetN), .enableSound(SW[9]), .twoSecPulse(twoSecPulse), .timeUp(timeUp),
    .levelUp(levelUp), .SHP_bumpyHeart(SHP_bumpyHeart), .SHP_bumpyDiamond(SHP_bumpyDiamond),
    .SHP_bumpyObstacle(SHP_bumpyObstacle), .SHP_bumpyCovid(SHP_bumpyCovid), .gameOver(gameOver),
    .shoot(inst114_out), .enable_out(inst106_enable_out), .tone(inst106_tone));
  not inst114 (inst114_out, KEY[0]);
  themeController #(.A(0), .B(1), .C(2), .D(3), .E(4), .F(5), .G(6), .A_TWO(7)) inst115 (
    .clk(CLOCK_50), .resetN(resetN), .enableSound(SW[9]), .twoSecPulse(twoSecPulse),
    .fourSecPulse(fourSecPulse), .eightSecPulse(eightSecPulse), .levelCode(levelCode),
    .enable_out(inst115_enable_out), .tone(inst115_tone));
  LPM_CONSTANT #(.LPM_CVALUE(0), .LPM_WIDTH(11)) inst73 (.result(inst73_result));
  LPM_CONSTANT #(.LPM_CVALUE(448), .LPM_WIDTH(11)) inst74 (.result(inst74_result));
  objects_mux_all inst11 (
    .clk(CLOCK_50), .resetN(resetN), .bumpyDrawingRequest(bumpy_req), .bumpyRGB(BUMPY_VGA),
    .floorDrawingRequest(floor_req), .floorRGB(FLOOR_VGA), .timeTensDrawingRequest(time_tens_req),
    .timeTensRGB(TIME_TENS_VGA), .timeOnesDrawingRequest(time_ones_req), .timeOnesRGB(TIME_ONES_VGA),
    .obstacleDrawingRequest(obstacle_req), .obstacleRGB(OBSTACLE_VGA),
    .steps_masterDrawingRequest(steps_master_req), .steps_masterRGB(STEPS_MASTER_VGA),
    .diamond_masterDrawingRequest(diamond_req), .diamond_masterRGB(DIAMOND_VGA),
    .heart_masterDrawingRequest(heart_req), .heart_masterRGB(HEART_VGA), .livesDrawingRequest(lives_req),
    .livesRGB(LIVES_VGA), .scoreDrawingRequest(score_req), .scoreRGB(SCORE_VGA),
    .bracketsDrawingRequest(brackets_req), .bracketsRGB(BRACKETS_VGA),
    .finishFlagDrawingRequest(finishFlag_req), .finishFlagRGB(FINISHFLAG_VGA),
    .shootDrawingRequest(shoot_req), .shootRGB(SHOOT_VGA), .levelSymbolDrawingRequest(levelSymbol_req),
    .levelSymbolRGB(LEVELSYMBOL_VGA), .ceilingDrawingRequest(ceiling_req), .ceilingRGB(CEILING_VGA),
    .leftWallDrawingRequest(leftWall_req), .leftWallRGB(LEFTWALL_VGA),
    .rightWallDrawingRequest(rightWall_req), .rightWallRGB(RIGHTWALL_VGA), .covidDrawingRequest(covid_req),
    .covidRGB(COVID_VGA), .backGroundRGB(BACKGROUND_VGA), .redOut(iRed), .greenOut(iGreen), .blueOut(iBlue));
  soundMux inst132 (
    .clk(CLOCK_50), .resetN(resetN), .levelCode(levelCode), .enableSound(SW[9]),
    .enable_out0(inst106_enable_out), .tone0(inst106_tone), .enable_out1(inst115_enable_out),
    .tone1(inst115_tone), .enable_out(inst132_enable_out), .tone(inst132_tone));
  square_object #(.OBJECT_WIDTH_X(32), .OBJECT_HEIGHT_Y(32), .OBJECT_COLOR(8'b01011011)) inst72 (
    .clk(CLOCK_50), .resetN(resetN), .pixelX(pixelX), .pixelY(pixelY), .topLeftX(inst73_result),
    .topLeftY(inst74_result), .offsetX(levelSymbol_offsetX), .offsetY(levelSymbol_offsetY),
    .drawingRequest(levelSymbol_insideRect));  // open: RGBout
  VGA_Controller VGA (
    .Red(iRed), .Green(iGreen), .Blue(iBlue), .clk(CLOCK_50), .resetN(resetN), .PixelX(pixelX),
    .PixelY(pixelY), .StartOfFrame(Start_of_frame), .oVGA_R(VGA_R), .oVGA_G(VGA_G), .oVGA_B(VGA_B),
    .oVGA_HS(VGA_HS), .oVGA_VS(VGA_VS), .oVGA_SYNC(VGA_SYNC_N), .oVGA_BLANK(VGA_BLANK_N), .oVGA_CLOCK(VGA_CLK));
  levelOneBitMap inst49 (
    .clk(CLOCK_50), .resetN(resetN), .offsetX(levelSymbol_offsetX), .offsetY(levelSymbol_offsetY),
    .InsideRectangle(levelSymbol_insideRect), .drawingRequest(inst49_drawingrequest), .RGBout(inst49_rgbout));  // open: HitEdgeCode
  levelTwoBitMap inst48 (
    .clk(CLOCK_50), .resetN(resetN), .offsetX(levelSymbol_offsetX), .offsetY(levelSymbol_offsetY),
    .InsideRectangle(levelSymbol_insideRect), .drawingRequest(inst48_drawingrequest), .RGBout(inst48_rgbout));  // open: HitEdgeCode
  winBitMap inst104 (
    .clk(CLOCK_50), .resetN(resetN), .offsetX(levelSymbol_offsetX), .offsetY(levelSymbol_offsetY),
    .InsideRectangle(levelSymbol_insideRect), .drawingRequest(inst104_drawingrequest), .RGBout(inst104_rgbout));  // open: HitEdgeCode
  gameOverBitMap inst105 (
    .clk(CLOCK_50), .resetN(resetN), .offsetX(levelSymbol_offsetX), .offsetY(levelSymbol_offsetY),
    .InsideRectangle(levelSymbol_insideRect), .drawingRequest(inst105_drawingrequest), .RGBout(inst105_rgbout));  // open: HitEdgeCode
  ToneDecoder inst3 (.tone(inst132_tone), .preScaleValue(inst3_prescalevalue));
  game_controller inst67 (
    .clk(CLOCK_50), .resetN(resetN), .startOfFrame(Start_of_frame), .drawing_request_Bumpy(bumpy_req),
    .drawing_request_floor(floor_req), .drawing_request_obstacle(obstacle_req),
    .drawing_request_steps(steps_master_req), .drawing_request_diamond(diamond_req),
    .drawing_request_heart(heart_req), .drawing_request_finishFlag(finishFlag_req),
    .drawing_request_shoot(shoot_req), .drawing_request_ceiling(ceiling_req),
    .drawing_request_leftWall(leftWall_req), .drawing_request_rightWall(rightWall_req),
    .drawing_request_covid(covid_req), .collision(collision), .SingleHitPulse(singleHit),
    .SHP_bumpyDiamond(SHP_bumpyDiamond), .SHP_bumpyHeart(SHP_bumpyHeart),
    .SHP_bumpyCollision(SHP_bumpyCollision), .SHP_obstacleCollision(SHP_obstacleCollision),
    .staticObjectReq(staticObjectReq), .SHP_bumpyFinishFlag(SHP_bumpyFinishFlag),
    .SHP_shootCollision(SHP_shootCollision), .SHP_shootObstacle(SHP_shootObstacle),
    .SHP_bumpyObstacle(SHP_bumpyObstacle), .SHP_bumpyCovid(SHP_bumpyCovid),
    .SHP_covidCollision(SHP_covidCollision), .SHP_shootCovid(SHP_shootCovid));
  level_fsm inst51 (
    .clk(CLOCK_50), .resetN(resetN), .gameOver(gameOver), .finishFlag(SHP_bumpyFinishFlag),
    .levelUp(levelUp), .levelCode(levelCode));
  SEG7 inst10 (.iDIG(inst132_tone), .oSEG(HEX0));
  not inst70 (inst70_out, levelUp);
  and inst69 (resetNLevel, resetN, inst70_out);
  TOP_MSS_DEMO inst9 (
    .AUD_ADCDAT(AUD_ADCDAT), .CLOCK_50(CLOCK_50), .resetN(resetN), .EnableSound(inst132_enable_out),
    .freq(inst3_prescalevalue), .MICROPHON_LED(MICROPHON_LED), .AUD_DACDAT(AUD_DACDAT), .AUD_XCK(AUD_XCK),
    .AUD_I2C_SCLK(AUD_I2C_SCLK), .AUD_ADCLRCK(AUD_ADCLRCK), .AUD_BCLK(AUD_BCLK), .AUD_DACLRCK(AUD_DACLRCK),
    .AUD_I2C_SDAT(AUD_I2C_SDAT));
  bitmapFourMux inst71 (
    .clk(CLOCK_50), .resetN(resetN), .levelCode(levelCode), .DrawingRequest0(inst49_drawingrequest),
    .RGB0(inst49_rgbout), .DrawingRequest1(inst48_drawingrequest), .RGB1(inst48_rgbout),
    .DrawingRequest2(inst104_drawingrequest), .RGB2(inst104_rgbout),
    .DrawingRequest3(inst105_drawingrequest), .RGB3(inst105_rgbout), .drawingRequest_out(levelSymbol_req),
    .RGBout(LEVELSYMBOL_VGA));

  // Other names for the same wires on the sheet: clk = CLOCK_50; jumpLeftN = KEY[3]; jumpRightN = KEY[1];
  //   jumpUpN = KEY[2]; shootN = KEY[0]; disableCovid = SW[7]; showFlag = SW[8]; enableSound = SW[9]; turbo = SW[2];
  //   VgaB[7:0] = VGA_B; vgaBlinkN = VGA_BLANK_N; vgaClk = VGA_CLK; VgaG[7:0] = VGA_G; VgaHS = VGA_HS;
  //   VgaR[7:0] = VGA_R; VgaSyncN = VGA_SYNC_N; VgaVS = VGA_VS

  // Notes on the sheet:
  //   FRAME
  //   TIMER
  //   BUMPY
  //   Control Unit
  //   SHOOT UNIT
  //   for turbo - at the end og the game
  //   Objects
  //   SUPRISES
  //   OBSTACLE
  //   SOUND UNIT
  //   Output to 7Seg
  //   COVID UNIT
  //   STEPS
  //   LEVELS BITMAPS
  //   LIVES ARRAY
  //   finishFlag
  //   BACKGROUND
  //   INTERFACE
  //   The keys  are active low
  //   SCORE
endmodule
